# EAGLE design EXT_TMC222 (EAGLE 6.5.0)
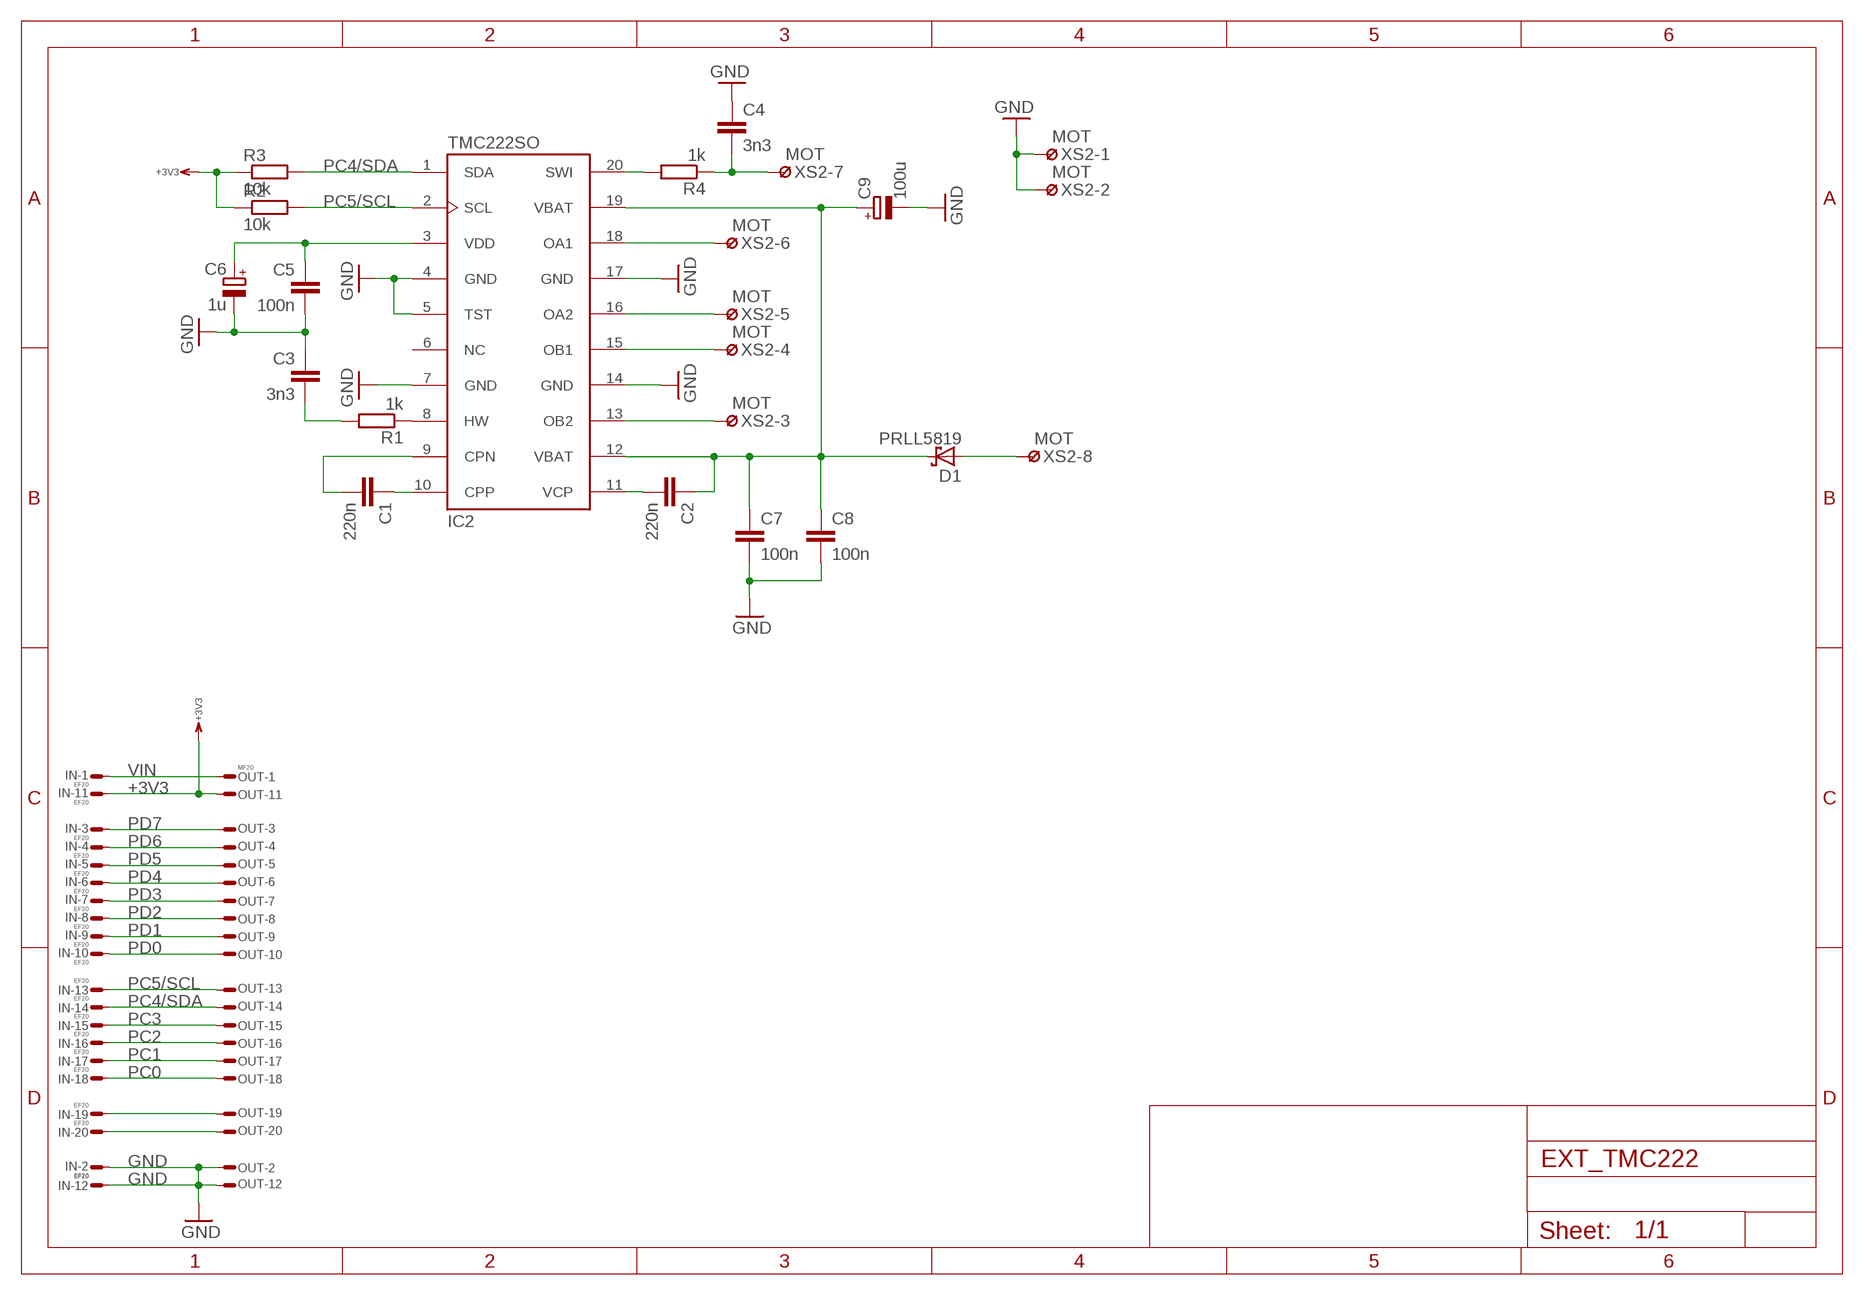
[diagram p0: schematic, sheet 1]

## Parts
C1  220n  C1206  [1206]
C2  220n  C1206  [1206]
C3  3n3  C0603  [0603]
C4  3n3  C0603  [0603]
C5  100n  C0603  [0603]
C6  1u  C_POLSMCA  [SMC_A]
C7  100n  C1206  [1206]
C8  100n  C1206  [1206]
C9  100u  C_POLE3.5-8  [E3,5-8]
D1  PRLL5819  D-SCHOTKY7  [SOD87]
IC2  TMC222SO  [SOIC20]
IN  EF20  FE20ELSS  [FE10-2WSS]
OUT  MF20  ML20LSE  [ML20LS]
R1  1k  R0603  [0603]
R2  10k  R0603  [0603]
R3  10k  R0603  [0603]
R4  1k  R0603  [0603]
XS2  MOT  CON8-SS381  [1727078]

## Nets
+3V3: IN.P$11 OUT.P$11 R2.1 R3.1
GND: C3.1 C4.1 C5.2 C6.- C7.2 C8.2 C9.- IC2.4(GND) IC2.5(TST) IC2.7(GND) IC2.14(GND) IC2.17(GND) IN.P$2 IN.P$12 OUT.P$2 OUT.P$12 XS2.P$1 XS2.P$2
N$1: IN.P$20 OUT.P$20
N$2: IC2.8(HW) R1.1
N$3: IN.P$19 OUT.P$19
N$4: IC2.20(SWI) R4.2
N$5: C1.1 IC2.10(CPP)
N$6: C1.2 IC2.9(CPN)
N$7: C2.2 IC2.11(VCP)
N$8: C2.1 C7.1 C8.1 C9.+ D1.C IC2.12(VBAT) IC2.19(VBAT)
N$9: C3.2 R1.2
N$10: C4.2 R4.1 XS2.P$7
N$11: C5.1 C6.+ IC2.3(VDD)
N$12: IC2.13(OB2) XS2.P$3
N$13: IC2.15(OB1) XS2.P$4
N$14: IC2.16(OA2) XS2.P$5
N$15: IC2.18(OA1) XS2.P$6
N$16: D1.A XS2.P$8
PC0: IN.P$18 OUT.P$18
PC1: IN.P$17 OUT.P$17
PC2: IN.P$16 OUT.P$16
PC3: IN.P$15 OUT.P$15
PC4/SDA: IC2.1(SDA) IN.P$14 OUT.P$14 R3.2
PC5/SCL: IC2.2(SCL) IN.P$13 OUT.P$13 R2.2
PD0: IN.P$10 OUT.P$10
PD1: IN.P$9 OUT.P$9
PD2: IN.P$8 OUT.P$8
PD3: IN.P$7 OUT.P$7
PD4: IN.P$6 OUT.P$6
PD5: IN.P$5 OUT.P$5
PD6: IN.P$4 OUT.P$4
PD7: IN.P$3 OUT.P$3
VIN: IN.P$1 OUT.P$1
Unconnected: IC2.6(NC)

## Library data of the parts
C1-C5 C7 C8 = RCL:C: Capacitor SMD
C6 C9 = RCL:C_POL: POLARIZED CAPACITOR, European symbol
D1 = Diode:D-SCHOTKY: Schottky Diode
IC2 = trinamic:TMC222
IN = Conn:FE20E
OUT = Conn:ML20?E: HARTING
R1-R4 = RCL:R: Resistor SMD
XS2 = Conn:CON8-S

## Board
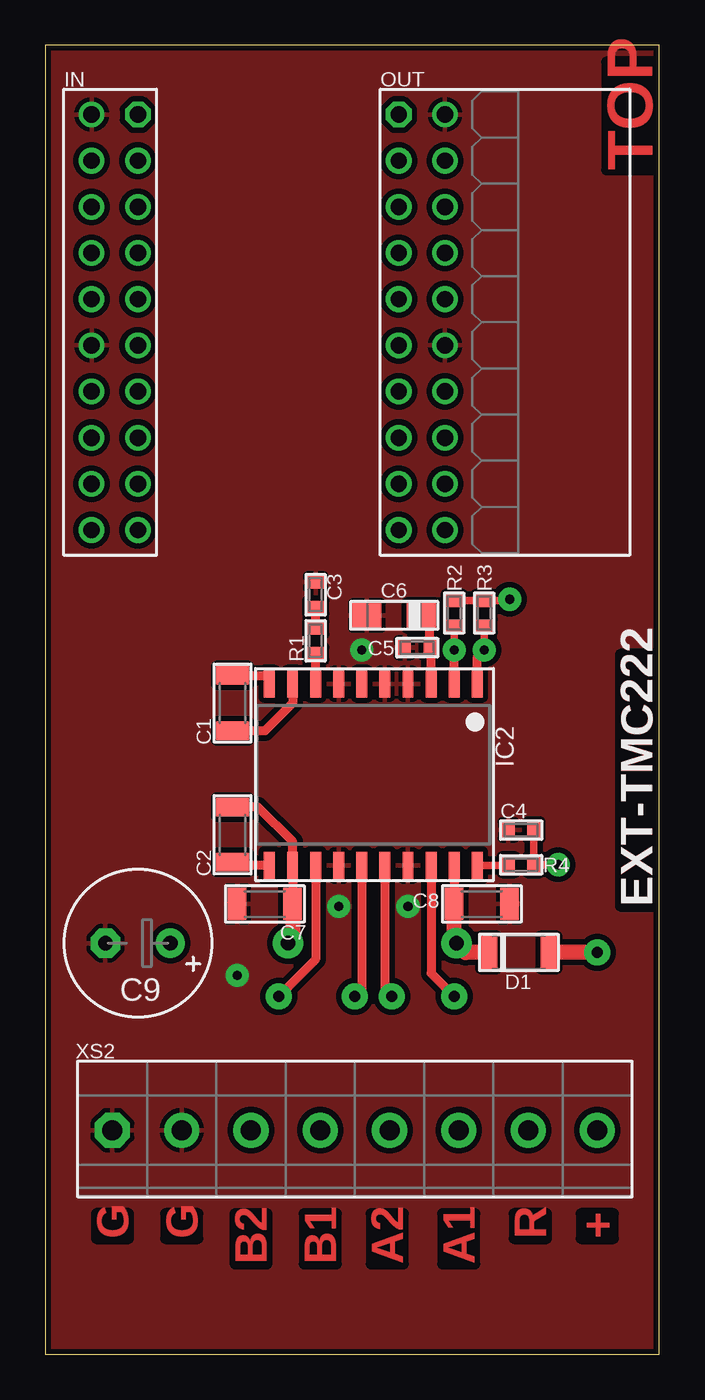
[diagram p1: board, top side]
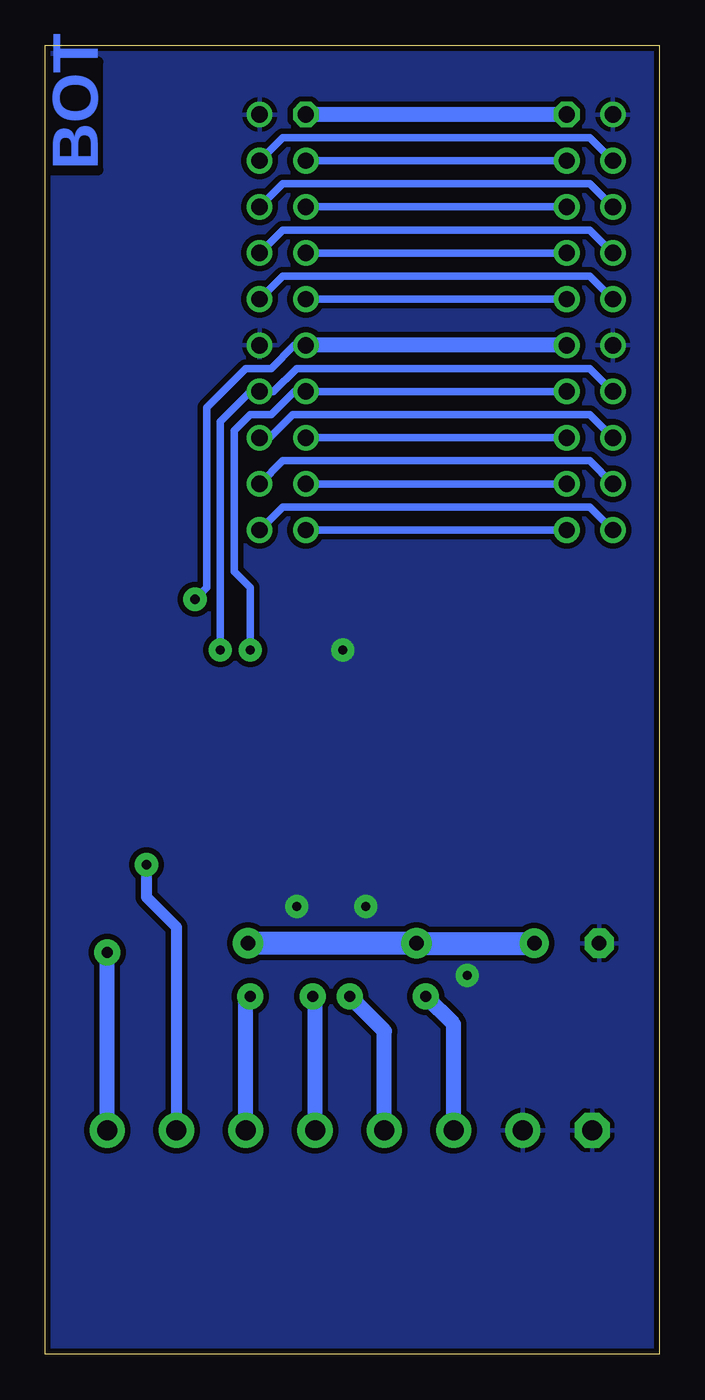
[diagram p2: board, bottom side, seen from below]

Size 33.75 x 72 mm. Coordinates in mm from the lower left corner, seen from the top.
Outline: 0,0 33.75,0 33.75,72 0,72 0,0
Copper layers (1*16): Top 0.035mm / dielectric 1.5mm / Bottom 0.035mm
Design rules "default *": minimum track width 10mil, minimum drill 10mil, track to track 12mil, track to pad 12mil, pad to pad 12mil, via to via 12mil, smd to smd 12mil, copper to edge 12mil, drill to drill 8mil, minimum pad ring 10mil, minimum via ring 8mil, stop-mask expansion 4mil, vias tented up to drill 0mil, thermal gap 10mil
tKeepout: area 0,0 to 33.8,2; area 0,70 to 22.5,72

### Footprints (pad centres in the part's own frame; a part is rotated, then mirrored left to right if it is on the bottom)
1206 = smd 1.016 x 1.778: 1 -1.524,0; 2 1.524,0
0603 = smd 0.7 x 0.9: 1 -0.697,0; 2 0.697,0
SMC_A = smd 1.6 x 1.4: + -1.5,0; - 1.5,0
E3,5-8 = drill 0.813 pad 1.6: + -1.778,0 | drill 0.813 pad 1.6 octagon: - 1.778,0
SOD87 = smd 0.9 x 1.8: A 1.65,0; C -1.65,0
SOIC20 = smd 0.6 x 1.5: 1 -5.715,-5; 2 -4.445,-5; 3 -3.175,-5; 4 -1.905,-5; 5 -0.635,-5; 6 0.635,-5; 7 1.905,-5; 8 3.175,-5; 9 4.445,-5; 10 5.715,-5; 11 5.715,5; 12 4.445,5; 13 3.175,5; 14 1.905,5; 15 0.635,5; 16 -0.635,5; 17 -1.905,5; 18 -3.175,5; 19 -4.445,5; 20 -5.715,5
FE10-2WSS = drill 0.9 octagon: P$1 -11.43,1.27 | drill 0.9: P$2 -11.43,-1.27; P$3 -8.89,1.27; P$4 -8.89,-1.27; P$5 -6.35,1.27; P$6 -6.35,-1.27; P$7 -3.81,1.27; P$8 -3.81,-1.27; P$9 -1.27,1.27; P$10 -1.27,-1.27; P$11 1.27,1.27; P$12 1.27,-1.27; P$13 3.81,1.27; P$14 3.81,-1.27; P$15 6.35,1.27; P$16 6.35,-1.27; P$17 8.89,1.27; P$18 8.89,-1.27; P$19 11.43,1.27; P$20 11.43,-1.27
ML20LS = drill 0.9 octagon: P$1 -11.43,-1.27 | drill 0.9: P$2 -11.43,1.27; P$3 -8.89,-1.27; P$4 -8.89,1.27; P$5 -6.35,-1.27; P$6 -6.35,1.27; P$7 -3.81,-1.27; P$8 -3.81,1.27; P$9 -1.27,-1.27; P$10 -1.27,1.27; P$11 1.27,-1.27; P$12 1.27,1.27; P$13 3.81,-1.27; P$14 3.81,1.27; P$15 6.35,-1.27; P$16 6.35,1.27; P$17 8.89,-1.27; P$18 8.89,1.27; P$19 11.43,-1.27; P$20 11.43,1.27
1727078 = drill 1.1 pad 1.93 octagon: P$1 -13.335,0 | drill 1.1 pad 1.93: P$2 -9.525,0; P$3 -5.715,0; P$4 -1.905,0; P$5 1.905,0; P$6 5.715,0; P$7 9.525,0; P$8 13.335,0

### Placement (x,y rotation side)
C1  10.29,35.81 270 top
C2  10.29,28.57 270 top
C3  14.86,41.78 270 top
C4  26.16,28.83 0 top
C5  20.45,38.86 180 top
C6  19.18,40.64 180 top
C7  12.06,24.77 180 top
C8  24,24.77 0 top
C9  5.08,22.61 180 top
D1  26.04,22.1 0 top
IC2  18.03,31.88 180 top
IN  3.81,56.77 270 top
OUT  20.7,56.77 270 top
R1  14.86,39.24 90 top
R2  22.48,40.77 270 top
R3  24.13,40.77 270 top
R4  26.16,26.92 180 top
XS2  17.02,12.32 0 top

### Tracks (layer width: path | path; a pad name or v marks a point on that pad's centre or on a via)
+3V3  (via drill 0.5 pad 1.27)
  Top 0.406: v25.53,41.53 25.46,41.46 R3.1 R2.1
  Bottom 0.406: v25.53,41.53 24.89,42.16 24.89,52.07 22.73,54.23 21.34,54.23 20.07,55.5 OUT.P$11
  Bottom 0.813: IN.P$11 OUT.P$11
GND  (via drill 0.5 pad 1.27)
  other vias: 10.54,20.83 17.4,38.73 16.13,24.64 19.94,24.64
  pour Bottom: 0,0.13 33.66,0.13 33.66,71.88 0,71.88
  pour Top: 0,0 33.66,0 33.66,71.88 0,71.88
N$1
  Bottom 0.406: IN.P$20 3.81,46.61 20.7,46.61 OUT.P$20
N$2
  Top 0.508: IC2.8 R1.1
N$3
  Bottom 0.406: IN.P$19 OUT.P$19
N$4
  Top 0.406: IC2.20 25.42,26.88 R4.2
N$5
  Top 0.508: C1.1 12.19,37.34 12.32,37.21 IC2.10
N$6
  Top 0.508: IC2.9 13.59,35.81 12.06,34.29 C1.2
N$7
  Top 0.508: IC2.11 10.46,26.88 C2.2
N$8  (via drill 0.8 pad 1.68)
  Top 0.508: C7.1 IC2.12 13.59,28.19 11.68,30.1 C2.1 | IC2.19 C8.1
  Top 0.813: C7.1 13.59,22.86 v13.34,22.61 | C8.1 22.48,22.73 v22.61,22.61 23.11,22.1 D1.C
  Bottom 1.27: v22.61,22.61 v13.34,22.61 C9.+
N$9
  Top 0.508: R1.2 C3.2
N$10  (via drill 0.5 pad 1.27)
  Top 0.406: C4.2 R4.1 v28.19,26.92
  Bottom 0.61: v28.19,26.92 28.19,25.15 26.54,23.5 XS2.P$7
N$11
  Top 0.508: IC2.3 21.21,38.8 C5.1 21.14,40.17 C6.+
N$12  (via drill 0.6 pad 1.42)
  Top 0.508: IC2.13 14.86,21.72 v12.83,19.68
  Bottom 0.813: XS2.P$3 11.3,18.16 v12.83,19.68
N$13  (via drill 0.6 pad 1.42)
  Top 0.508: IC2.15 17.4,20.07 v17.02,19.68
  Bottom 0.813: XS2.P$4 15.11,17.78 v17.02,19.68
N$14  (via drill 0.6 pad 1.42)
  Top 0.508: IC2.16 18.67,20.07 v19.05,19.68
  Bottom 0.813: XS2.P$5 18.92,19.56 v19.05,19.68
N$15  (via drill 0.6 pad 1.42)
  Top 0.508: IC2.18 21.21,20.95 v22.48,19.68
  Bottom 0.813: XS2.P$6 22.73,19.43 v22.48,19.68
N$16  (via drill 0.6 pad 1.42)
  Top 0.813: v30.35,22.1 D1.A
  Bottom 0.813: XS2.P$8 v30.35,22.1
PC0
  Bottom 0.406: IN.P$18 3.81,49.15 20.7,49.15 OUT.P$18
PC1
  Bottom 0.406: IN.P$17 OUT.P$17
PC2
  Bottom 0.406: OUT.P$16 21.41,50.42 20.14,51.69 3.81,51.69 IN.P$16
PC3
  Bottom 0.406: IN.P$15 OUT.P$15
PC4/SDA  (via drill 0.5 pad 1.27)
  Top 0.406: R3.2 v24.13,38.73
  Top 0.508: IC2.1 23.75,38.35 v24.13,38.73
  Bottom 0.406: IN.P$14 3.81,54.23 19.94,54.23 21.21,52.96 OUT.P$14 22.48,52.96 24.13,51.31 v24.13,38.73
PC5/SCL  (via drill 0.5 pad 1.27)
  Top 0.406: R2.2 v22.48,38.73
  Top 0.508: IC2.2 v22.48,38.73
  Bottom 0.406: IN.P$13 OUT.P$13 20.07,52.96 21.34,51.69 22.48,51.69 23.37,50.8 23.37,43.05 22.48,42.16 v22.48,38.73
PD0
  Bottom 0.406: IN.P$10 3.81,59.31 20.7,59.31 OUT.P$10
PD1
  Bottom 0.406: IN.P$9 OUT.P$9
PD2
  Bottom 0.406: IN.P$8 3.81,61.85 20.7,61.85 OUT.P$8
PD3
  Bottom 0.406: IN.P$7 OUT.P$7
PD4
  Bottom 0.406: IN.P$6 3.81,64.39 20.7,64.39 OUT.P$6
PD5
  Bottom 0.406: IN.P$5 OUT.P$5
PD6
  Bottom 0.406: IN.P$4 3.81,66.93 20.7,66.93 OUT.P$4
PD7
  Bottom 0.406: IN.P$3 OUT.P$3
VIN
  Bottom 0.813: IN.P$1 OUT.P$1

### Text on the board
Top: TOP | EXT-TMC222 | G | G | R | + | B2 | B1 | A2 | A1
Bottom: BOT
tNames: EXT-TMC222